# Altium schematic sheet 03 - Interfaces.SchDoc: Ethernet connections
size A4; SheetNumber: 3; SheetTotal: 4
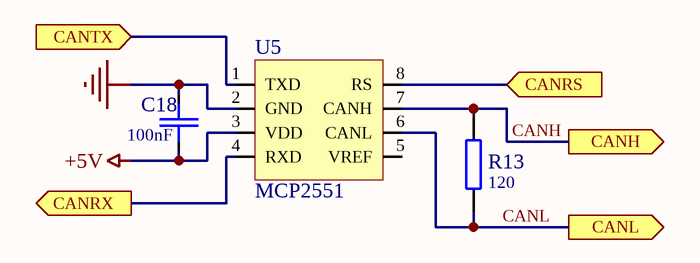
[diagram p0: 03 - Interfaces.SchDoc]

## Parts
C18  100nF  [CAP: 0805]
R13  120  [RES: 0805]
U5  MCP2551  [SOIC-8N]

## Ports
CANH (out), CANL (out), CANRS (in), CANRX (out), CANTX (in)

## Nets
+5V: C18.1 U5.3(VDD)
GND: C18.2 U5.2(GND)
CANH: R13.2 U5.7(CANH) ; port CANH
CANL: R13.1 U5.6(CANL) ; port CANL
CANRS: U5.8(RS) ; port CANRS
CANRX: U5.4(RXD) ; port CANRX
CANTX: U5.1(TXD) ; port CANTX

Not connected (* = marked no-connect by the designer): U5 5(VREF)

## Library data of the parts
C18 = C-0805: SMD-0805; Price: 0.014; Value: 100nF
R13 = R-0805: SMD 0805 0.1W 5% 150V; Price: 0.017; Value: 120